# EAGLE design kakaru (EAGLE 5.11)
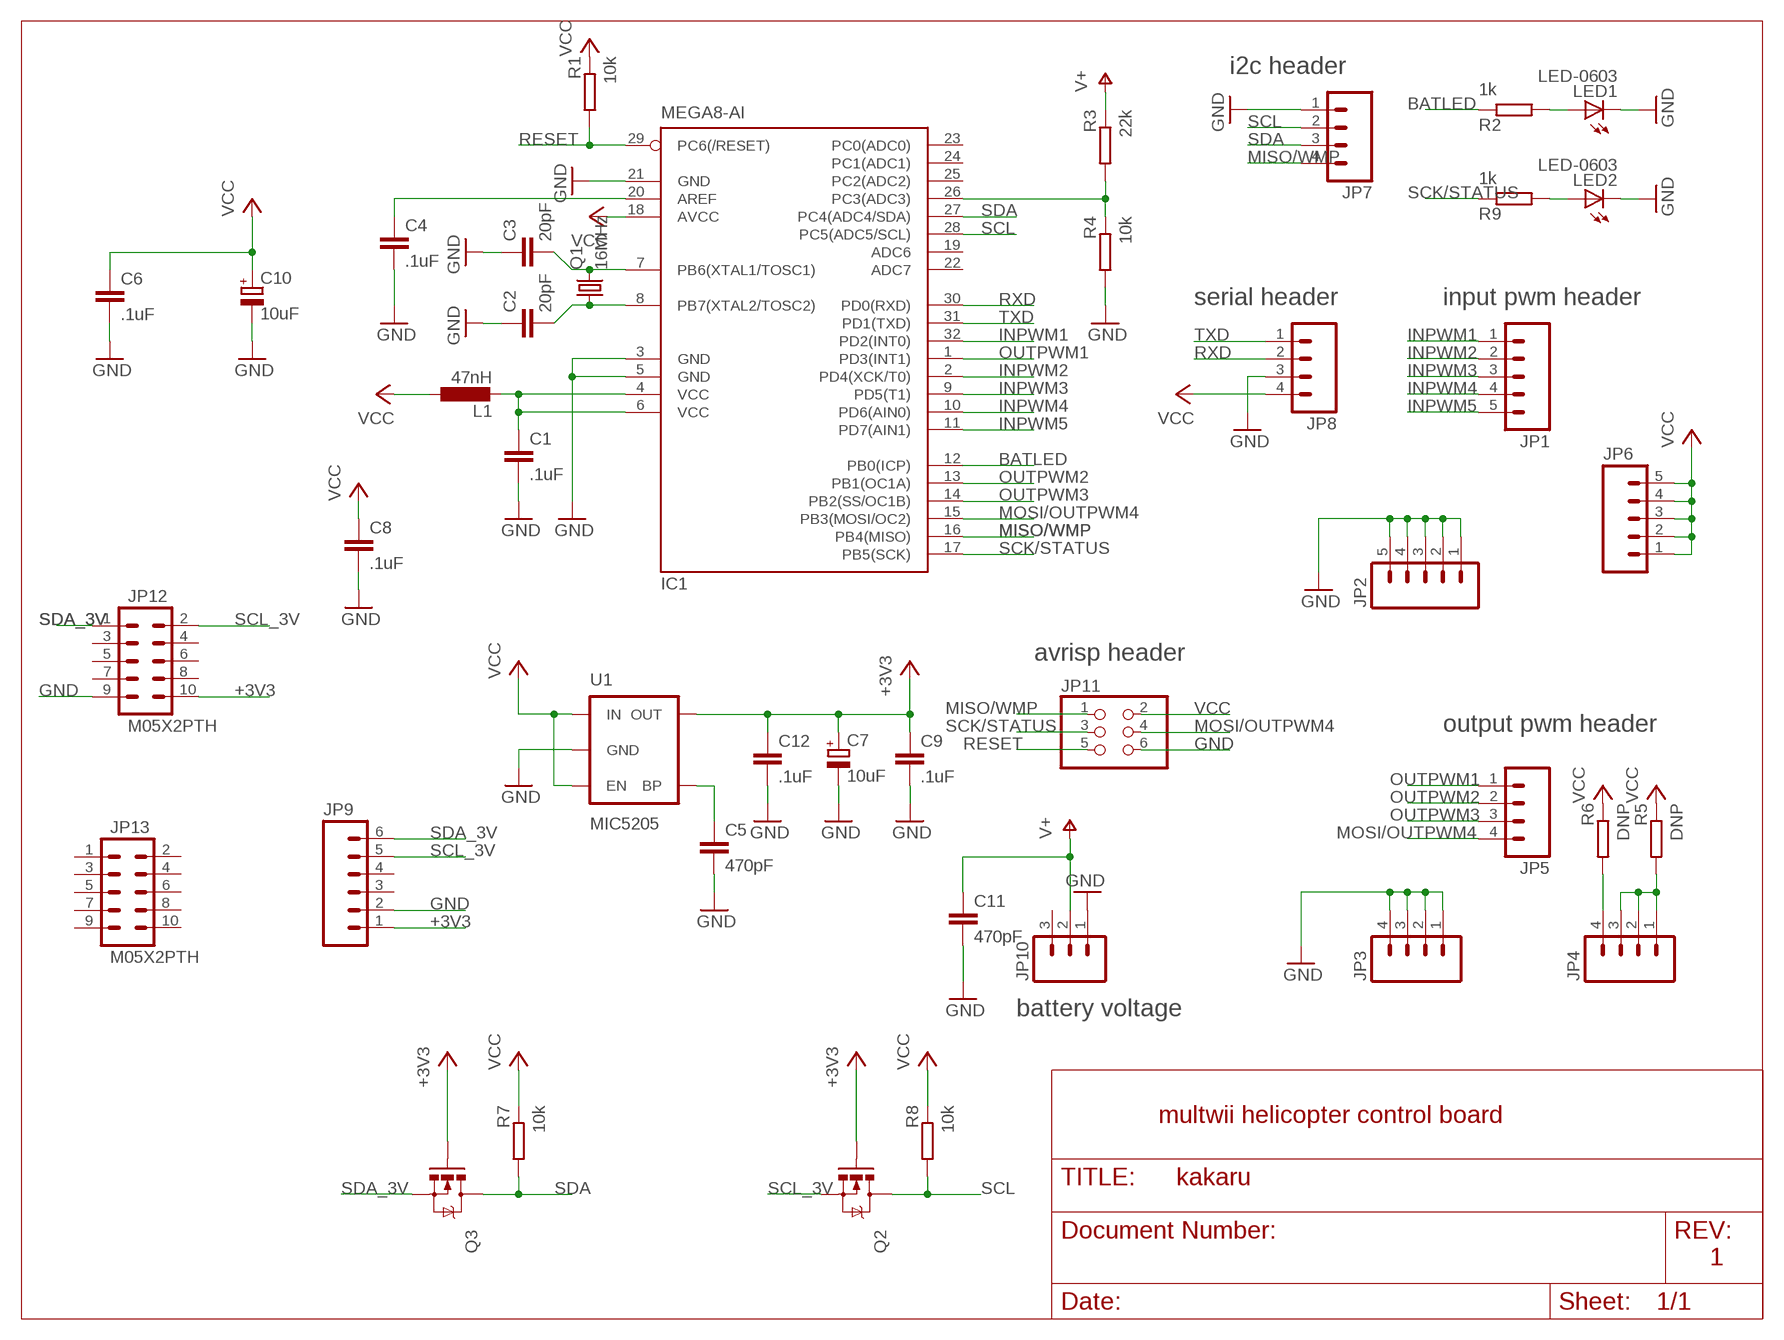
[diagram p0: schematic, sheet 1]

## Parts
C1  .1uF  CAPACITOR-0603  [0603-CAP]
C2  20pF  CAPACITOR-0603  [0603-CAP]
C3  20pF  CAPACITOR-0603  [0603-CAP]
C4  .1uF  CAPACITOR-0603  [0603-CAP]
C5  470pF  CAPACITOR-0603  [0603-CAP]
C6  .1uF  CAPACITOR-0603  [0603-CAP]
C7  10uF  CPOL-EUCT3216  [CT3216]
C8  .1uF  CAPACITOR-0603  [0603-CAP]
C9  .1uF  CAPACITOR-0603  [0603-CAP]
C10  10uF  CPOL-EUCT3216  [CT3216]
C11  470pF  CAPACITOR-0603  [0603-CAP]
C12  .1uF  CAPACITOR-0603  [0603-CAP]
IC1  MEGA8-AI  [TQFP32-08]
JP1  M05PTH  [1X05]
JP2  M05PTH  [1X05]
JP3  M04PTH  [1X04]
JP4  M04PTH  [1X04]
JP5  M04PTH  [1X04]
JP6  M05PTH  [1X05]
JP7  M04PTH  [1X04]
JP8  M04PTH  [1X04]
JP9  M06SIP  [1X06]
JP10  M03PTH  [1X03]
JP11  PINHD-2X3  [2X03]
JP12  M05X2PTH  [AVR_ICSP]
JP13  M05X2PTH  [AVR_ICSP]
L1  47nH  INDUCTOR-0603  [0603-IND]
LED1  LED-0603  [0603-LED]
LED2  LED-0603  [0603-LED]
Q1  16MHz  CRYSTALCTS406  [CTS406]
Q2  MOSFET-NCHANNELSMD  [SOT23-3]
Q3  MOSFET-NCHANNELSMD  [SOT23-3]
R1  10k  RESISTOR-0603  [0603-RES]
R2  1k  RESISTOR-0603  [0603-RES]
R3  22k  RESISTOR-0603  [0603-RES]
R4  10k  RESISTOR-0603  [0603-RES]
R5  DNP  RESISTOR-0603  [0603-RES]
R6  DNP  RESISTOR-0603  [0603-RES]
R7  10k  RESISTOR-0603  [0603-RES]
R8  10k  RESISTOR-0603  [0603-RES]
R9  1k  RESISTOR-0603  [0603-RES]
U1  MIC5205  V_REG_LDOSMD  [SOT23-5]

## Nets
+3V3: C7.+ C9.P$1 C12.P$1 JP9.1 JP12.10 Q2.1(G) Q3.1(G) U1.5(OUT)
BATLED: IC1.12(PB0(ICP)) R2.P$1
GND: C1.P$2 C2.P$1 C3.P$1 C4.P$2 C5.P$2 C6.P$2 C7.- C8.P$2 C9.P$2 C10.- C11.P$2 C12.P$2 IC1.3(GND) IC1.5(GND) IC1.21(GND) JP2.1 JP2.2 JP2.3 JP2.4 JP2.5 JP3.1 JP3.2 JP3.3 JP3.4 JP7.1 JP8.3 JP9.2 JP10.1 JP11.6 JP12.9 LED1.C LED2.C R4.P$2 U1.2(GND)
INPWM1: IC1.32(PD2(INT0)) JP1.1
INPWM2: IC1.2(PD4(XCK/T0)) JP1.2
INPWM3: IC1.9(PD5(T1)) JP1.3
INPWM4: IC1.10(PD6(AIN0)) JP1.4
INPWM5: IC1.11(PD7(AIN1)) JP1.5
MISO/WMP: IC1.16(PB4(MISO)) JP7.4 JP11.1
MOSI/OUTPWM4: IC1.15(PB3(MOSI/OC2)) JP5.4 JP11.4
N$1: C1.P$1 IC1.4(VCC) IC1.6(VCC) L1.P$2
N$2: C3.P$2 IC1.7(PB6(XTAL1/TOSC1)) Q1.3
N$3: C2.P$2 IC1.8(PB7(XTAL2/TOSC2)) Q1.1
N$4: JP4.4 R6.P$2
N$5: C5.P$1 U1.4(BP)
N$6: C4.P$1 IC1.20(AREF)
N$7: JP4.1 JP4.2 JP4.3 R5.P$2
N$8: LED1.A R2.P$2
N$9: LED2.A R9.P$2
N$11: IC1.26(PC3(ADC3)) R3.P$2 R4.P$1
OUTPWM1: IC1.1(PD3(INT1)) JP5.1
OUTPWM2: IC1.13(PB1(OC1A)) JP5.2
OUTPWM3: IC1.14(PB2(SS/OC1B)) JP5.3
RESET: IC1.29(PC6(/RESET)) JP11.5 R1.P$2
RXD: IC1.30(PD0(RXD)) JP8.2
SCK/STATUS: IC1.17(PB5(SCK)) JP11.3 R9.P$1
SCL: IC1.28(PC5(ADC5/SCL)) JP7.2 Q2.3(D) R8.P$2
SCL_3V: JP9.5 JP12.2 Q2.2(S)
SDA: IC1.27(PC4(ADC4/SDA)) JP7.3 Q3.3(D) R7.P$2
SDA_3V: JP9.6 JP12.1 Q3.2(S)
TXD: IC1.31(PD1(TXD)) JP8.1
V+: C11.P$1 JP10.2 R3.P$1
VCC: C6.P$1 C8.P$1 C10.+ IC1.18(AVCC) JP6.1 JP6.2 JP6.3 JP6.4 JP6.5 JP8.4 JP11.2 L1.P$1 R1.P$1 R5.P$1 R6.P$1 R7.P$1 R8.P$1 U1.1(IN) U1.3(EN)
Unconnected: IC1.19(ADC6) IC1.22(ADC7) IC1.23(PC0(ADC0)) IC1.24(PC1(ADC1)) IC1.25(PC2(ADC2)) JP9.3 JP9.4 JP10.3 JP12.3 JP12.4 JP12.5 JP12.6 JP12.7 JP12.8 JP13.1 JP13.2 JP13.3 JP13.4 JP13.5 JP13.6 JP13.7 JP13.8 JP13.9 JP13.10

## Notes on the sheet
- i2c header
- serial header | input pwm header
- avrisp header
- output pwm header
- battery voltage
- multwii helicopter control board
- 1

## Library data of the parts
C1-C6 C8 C9 C11 C12 = pel_dipol_comp:CAPACITOR
C7 C10 = rcl:CPOL-EU: POLARIZED CAPACITOR, European symbol
IC1 = atmel:MEGA8: MICROCONTROLLER 8 Kbytes FLASH, 1 kbytes SRAM, 512 bytes EEPROM, USART, 6-channel 10 bit ADC, 2-channel 8 bit ADC Pin compatible with Atmega48, ATMega88, ATMega168 Source: avr.lbr; MPN: ATMEGA8-16AU; OC_FARNELL: 9171371; OC_NEWARK: 73M8863
JP1 JP2 JP6 = SparkFun:M05: Header 5 Standard 5-pin 0.1" header. Use with straight break away headers (SKU : PRT-00116), right angle break away headers (PRT-00553), swiss pins (PRT-00743), machine pins (PRT-00117), and female headers (PRT-00115). Molex polarized connector foot print use with SKU : PRT-08230 with associated crimp pins and housings.
JP3-JP5 JP7 JP8 = SparkFun:M04: Header 4 Standard 4-pin 0.1" header. Use with straight break away headers (SKU : PRT-00116), right angle break away headers (PRT-00553), swiss pins (PRT-00743), machine pins (PRT-00117), and female headers (PRT-00115). Molex polarized connector foot print use with SKU : PRT-08231 with associated crimp pins and housings. 1MM SMD Version SKU: PRT-10208
JP9 = SparkFun:M06: Header 6 Standard 6-pin 0.1" header. Use with straight break away headers (SKU : PRT-00116), right angle break away headers (PRT-00553), swiss pins (PRT-00743), machine pins (PRT-00117), and female headers (PRT-00115). Molex polarized connector foot print use with SKU : PRT-08094 with associated crimp pins and housings. NOTES ON THE VARIANTS LOCK and LOCK_LONGPADS... This footprint was designed to help hold the alignment of a through-hole component (i.e. 6-pin header) while soldering it into place. You may notice that each hole has been shifted either up or down by 0.005 of an inch from it's more standard position (which is a perfectly straight line). This slight alteration caused the pins (the squares in the middle) to touch the edges of the holes. Because they are alternating, it causes a "brace" to hold the component in place. 0.005 has proven to be the perfect amount of "off-center" position when using our standard breakaway headers. Although looks a little odd when you look at the bare footprint, once you have a header in there, the alteration is very hard to notice. Also, if you push a header all the way into place, it is covered up entirely on the bottom side. This idea of altering the position of holes to aid alignment will be further integrated into the Sparkfun Library for other footprints. It can help hold any component with 3 or more connection pins.
JP10 = SparkFun:M03: Header 3 Standard 3-pin 0.1" header. Use with straight break away headers (SKU : PRT-00116), right angle break away headers (PRT-00553), swiss pins (PRT-00743), machine pins (PRT-00117), and female headers (PRT-00115). Molex polarized connector foot print use with SKU : PRT-08232 with associated crimp pins and housings.
JP11 = pinhead:PINHD-2X3: PIN HEADER
JP12 JP13 = SparkFun:M05X2: Header 5x2 Standard 10-pin dual row 0.1" header. Commonly used with AVR-ISP. Use with Spark Fun Electronics SKU: PRT-00778
L1 = pel_dipol_comp:INDUCTOR
LED1 LED2 = pel_dipol_comp:LED
Q1 = crystal:CRYSTAL: CRYSTAL; OC_FARNELL: unknown; OC_NEWARK: unknown
Q2 Q3 = SparkFun:MOSFET-NCHANNEL
R1-R9 = pel_dipol_comp:RESISTOR
U1 = SparkFun:V_REG_LDO: Voltage Regulator LDO Standard 150mA LDO voltage regulator in SOT-23 layout. Micrel part MIC5205. BP (by-pass) pin is used to lower output noise with 470pF cap.

## Board
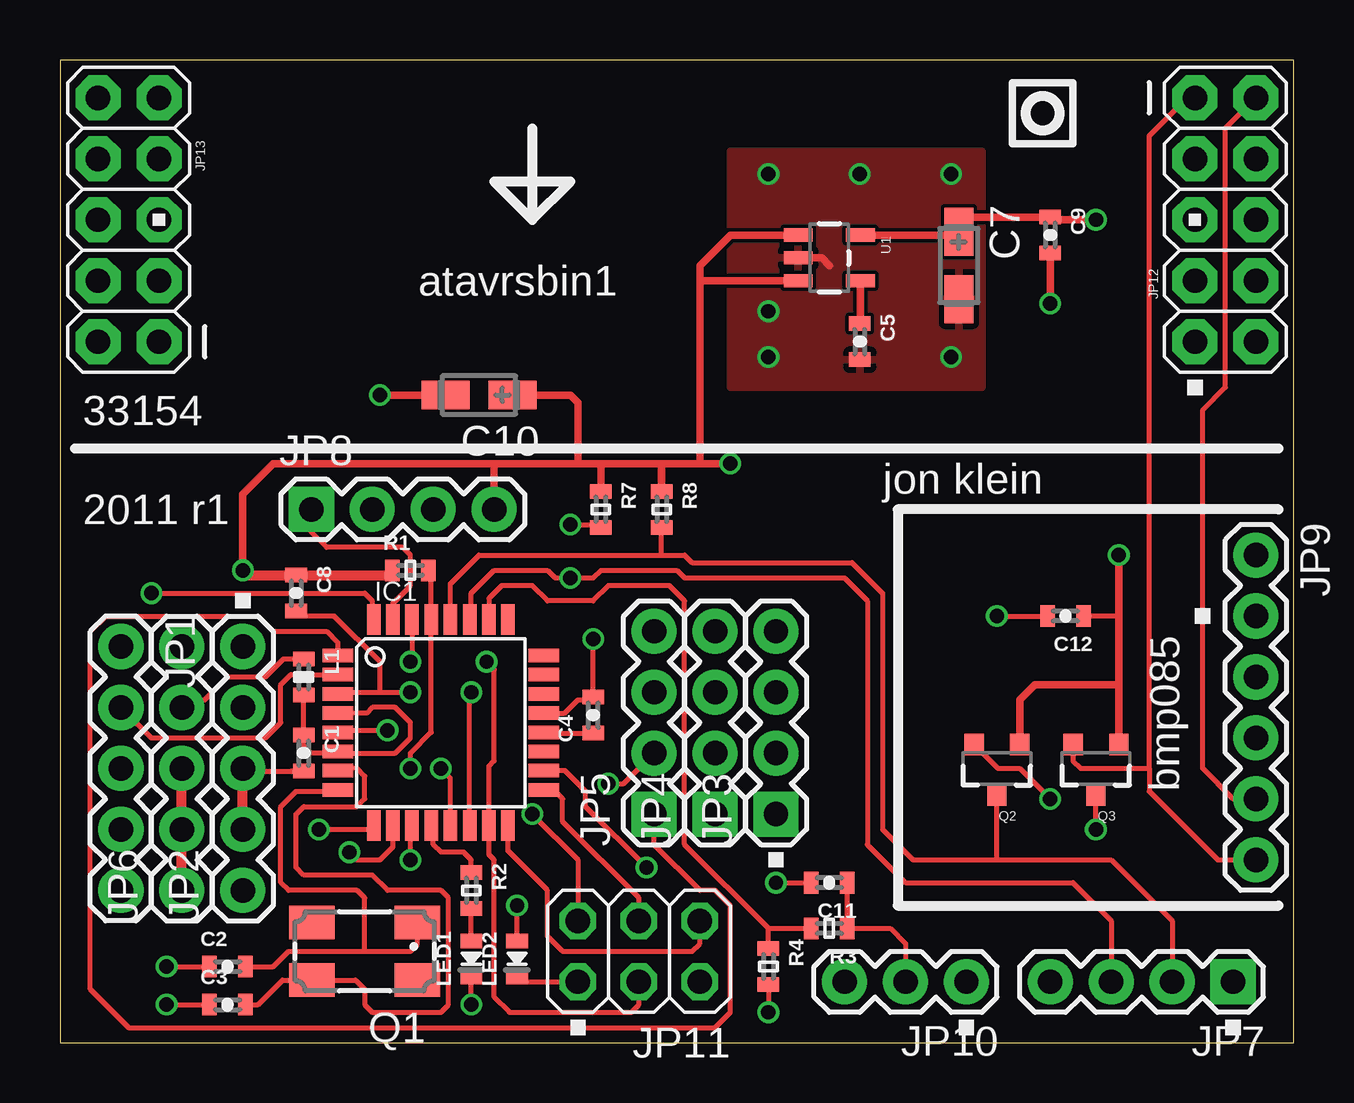
[diagram p1: board, top side]
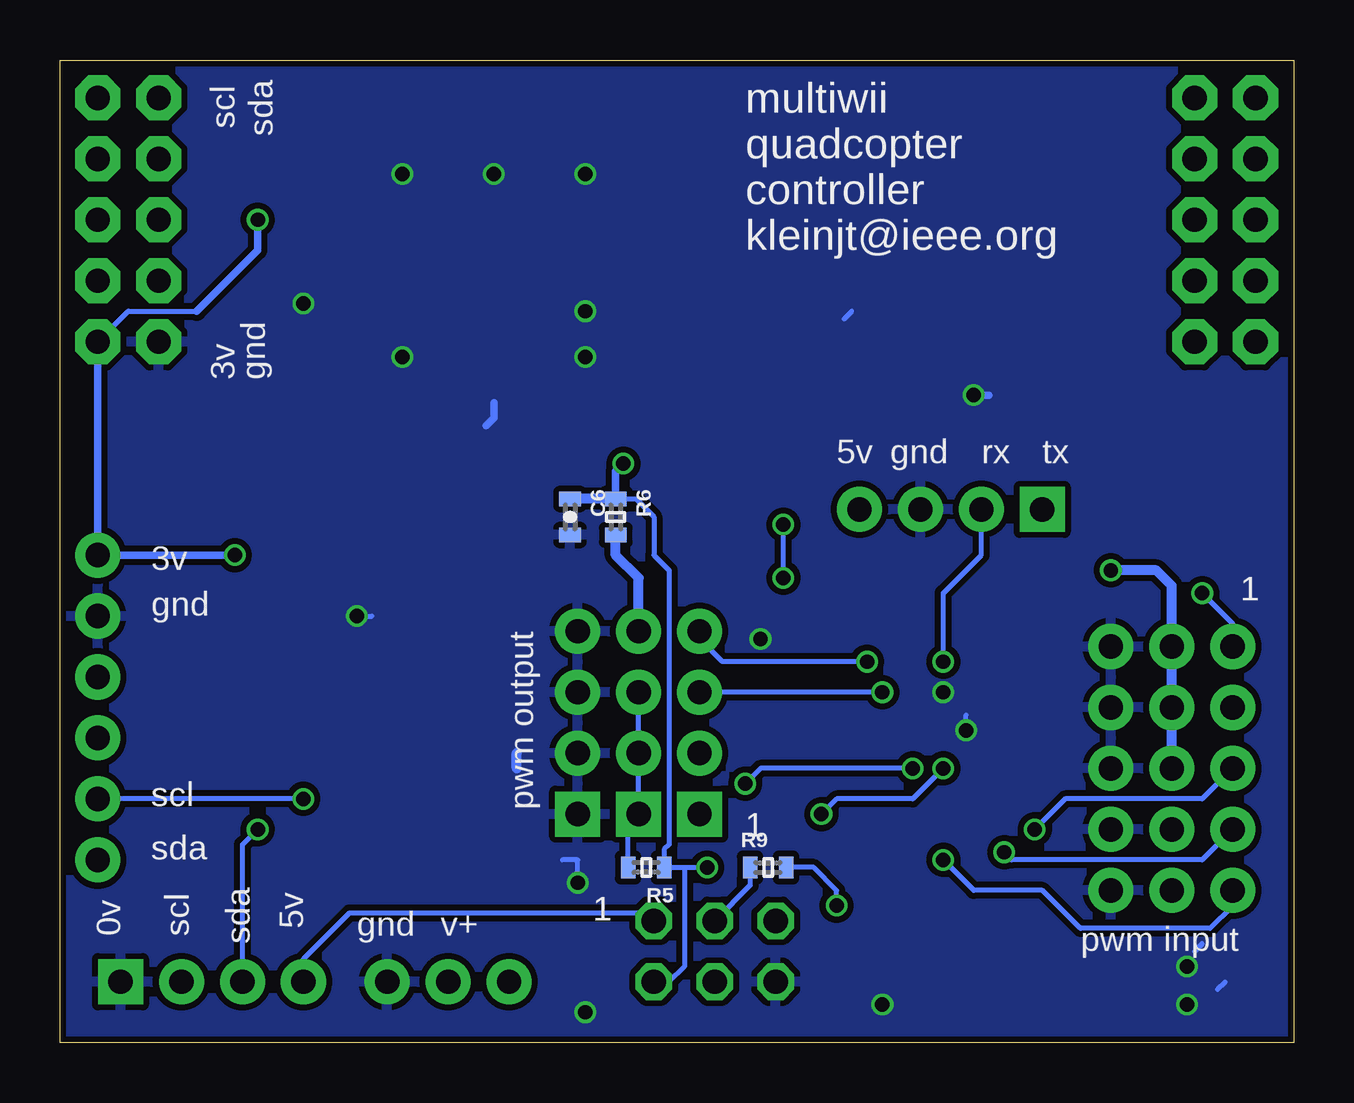
[diagram p2: board, bottom side, seen from below]

Size 51.42 x 40.95 mm. Coordinates in mm from the lower left corner, seen from the top.
Outline: 0,0 51.42,0 51.42,40.95 0,40.95 0,0
Copper layers (1*16): Top 0.035mm / dielectric 1.5mm / Bottom 0.035mm
Design rules "Fusion_eagle_rule_v1.1": minimum track width 6mil, minimum drill 12mil, track to track 6mil, track to pad 6mil, pad to pad 6mil, via to via 6mil, smd to smd 0mil, copper to edge 10mil, drill to drill 10mil, minimum pad ring 10mil, minimum via ring 6mil, stop-mask expansion 2mil, vias tented up to drill 100mil, thermal gap 10mil

### Footprints (pad centres in the part's own frame; a part is rotated, then mirrored left to right if it is on the bottom)
0603-CAP = smd 0.6 x 0.9: P$1 -0.75,0; P$2 0.75,0
CT3216 = smd 2 x 1.2: + -1.4,0; - 1.4,0
TQFP32-08 = smd 1.27 x 0.559: 1 -4.293,2.8; 2 -4.293,2; 3 -4.293,1.2; 4 -4.293,0.4; 5 -4.293,-0.4; 6 -4.293,-1.2; 7 -4.293,-2; 8 -4.293,-2.8; 17 4.293,-2.8; 18 4.293,-2; 19 4.293,-1.2; 20 4.293,-0.4; 21 4.293,0.4; 22 4.293,1.2; 23 4.293,2; 24 4.293,2.8 | smd 0.559 x 1.27: 9 -2.8,-4.293; 10 -2,-4.293; 11 -1.2,-4.293; 12 -0.4,-4.293; 13 0.4,-4.293; 14 1.2,-4.293; 15 2,-4.293; 16 2.8,-4.293; 25 2.8,4.293; 26 2,4.293; 27 1.2,4.293; 28 0.4,4.293; 29 -0.4,4.293; 30 -1.2,4.293; 31 -2,4.293; 32 -2.8,4.293
1X05 = drill 1.016 pad 1.88 round: 1 0,0; 2 2.54,0; 3 5.08,0; 4 7.62,0; 5 10.16,0
1X04 = drill 1.016 pad 1.88 square: 1 0,0 | drill 1.016 pad 1.88 round: 2 2.54,0; 3 5.08,0; 4 7.62,0
1X06 = drill 1.016 pad 1.88 round: 1 0,0; 2 2.54,0; 3 5.08,0; 4 7.62,0; 5 10.16,0; 6 12.7,0
1X03 = drill 1.016 pad 1.88 round: 1 0,0; 2 2.54,0; 3 5.08,0
2X03 = drill 1.016 octagon: 1 -2.54,-1.27; 2 -2.54,1.27; 3 0,-1.27; 4 0,1.27; 5 2.54,-1.27; 6 2.54,1.27
AVR_ICSP = drill 1.016 pad 1.88 octagon: 1 -1.27,5.08; 2 1.27,5.08; 3 -1.27,2.54; 4 1.27,2.54; 5 -1.27,0; 6 1.27,0; 7 -1.27,-2.54; 8 1.27,-2.54; 9 -1.27,-5.08; 10 1.27,-5.08
0603-IND = smd 0.6 x 0.9: P$1 -0.75,0; P$2 0.75,0
0603-LED = smd 0.6 x 0.9: A 0.75,0; C -0.75,0
CTS406 = smd 1.9 x 1.4: 1 -2.2,-1.2; 2 2.2,-1.2; 3 2.2,1.2; 4 -2.2,1.2
SOT23-3 = smd 0.8 x 0.9: 1 -0.95,-1; 2 0.95,-1; 3 0,1.1
0603-RES = smd 0.6 x 0.9: P$1 -0.75,0; P$2 0.75,0
SOT23-5 = smd 0.55 x 1.2: 1 -0.95,-1.3; 2 0,-1.3; 3 0.95,-1.3; 4 0.95,1.3; 5 -0.95,1.3

### Placement (x,y rotation side)
C1  10.16,12.06 270 top
C2  6.99,3.17 0 top
C3  6.99,1.59 0 top
C4  22.23,13.65 90 top
C5  33.34,29.21 270 top
C6  30.16,21.91 270 bottom
C7  37.47,32.38 270 top
C8  9.84,18.73 270 top
C9  41.27,33.66 270 top
C10  17.46,26.99 180 top
C11  32.07,6.67 180 top
C12  41.91,17.78 180 top
IC1  15.88,13.34 0 top
JP1  2.54,16.51 270 top
JP2  7.62,6.35 90 top
JP3  29.84,9.53 90 top
JP4  27.3,9.53 90 top
JP5  24.77,9.53 90 top
JP6  5.08,6.35 90 top
JP7  48.9,2.54 180 top
JP8  10.48,22.23 0 top
JP9  49.85,20.32 270 top
JP10  37.78,2.54 180 top
JP11  24.13,3.81 180 top
JP12  48.58,34.29 0 top
JP13  2.86,34.29 180 top
L1  10.16,15.24 270 top
LED1  17.14,3.49 90 top
LED2  19.05,3.49 90 top
Q1  12.7,3.81 180 top
Q2  39.05,11.43 180 top
Q3  43.18,11.43 180 top
R1  14.61,19.68 0 top
R2  17.14,6.35 270 top
R3  32.07,4.76 180 top
R4  29.53,3.17 270 top
R5  26.99,7.3 180 bottom
R6  28.26,21.91 270 bottom
R7  22.54,22.23 270 top
R8  25.08,22.23 270 top
R9  21.91,7.3 0 bottom
U1  32.07,32.7 270 top

### Tracks (layer width: path | path; a pad name or v marks a point on that pad's centre or on a via)
+3V3  (via drill 0.6)
  Top 0.203: Q3.1 | Q2.1 | 44.13,17.78 C12.P$1
  Top 0.305: 44.13,14.92 Q3.1 | 44.13,14.92 44.13,17.78 44.13,19.05 v44.13,20.32 | Q2.1 40.01,14.29 40.64,14.92 44.13,14.92 | U1.5 37.33,33.65 C7.+ 37.47,34.29 37.58,34.41 C9.P$1 41.27,34.29 v43.18,34.29
  Bottom 0.203: 45.72,30.48 48.58,30.48 JP12.10
  Bottom 0.305: v44.13,20.32 JP9.1 JP12.10 | v43.18,34.29 43.18,33.02 45.72,30.48
BATLED
  Top 0.203: IC1.12 15.56,8.96 15.56,8.26 15.88,7.94 16.83,7.94 17.14,7.62 R2.P$1
GND  (via drill 0.6)
  Top 0.203: 11.14,12.94 IC1.5 11.66,13.02 v13.65,13.02 | v4.45,1.59 C3.P$1 | v4.45,3.17 C2.P$1 | 13.34,14.61 13.34,15.88 11.43,17.78 10.04,17.78 C8.P$2 | 9.64,11.31 C1.P$2 7.74,11.31 JP2.3 | IC1.3 11.65,14.61 13.34,14.61 | 13.34,14.61 v14.61,14.61 | v17.14,1.59 LED1.C | R4.P$2 v29.53,1.27 | v29.84,6.67 C11.P$2 | IC1.21 21.04,13.73 21.59,14.29 22.11,14.29 C4.P$2 v22.23,16.83 | LED2.C 19.25,2.54 JP11.6 | v39.05,17.78 C12.P$2
  Top 0.305: C9.P$2 41.39,33.02 | C9.P$2 41.27,33.02 | C9.P$2 v41.27,30.8 | v13.34,26.99 C10.- | U1.2 31.75,32.7 32.07,32.38
  Top 0.406: JP2.2 JP2.3
  Bottom 0.203: 30.48,7.62 29.84,7.62 v29.84,6.67 | 3.17,2.22 2.86,2.54 | 3.81,4.13 4.13,3.81 | v13.65,13.02 13.65,13.65 | v14.61,14.61 14.92,14.61 | v29.53,1.27 29.84,1.27 | 18.73,30.16 18.41,30.48 | v22.23,16.83 22.23,17.14 | v39.05,17.78 38.42,17.78
  Bottom 0.305: v13.34,26.99 12.7,26.99 | 33.34,26.67 33.34,26.04 33.66,25.72
  Bottom 0.406: 32.38,11.43 32.38,12.06
  other vias: 37.15,28.57 29.53,28.57 29.53,30.48 29.53,36.2 37.15,36.2 33.34,36.2
  pour Bottom (isolate 0.254): 0.32,40.96 0,0 51.12,0 51.44,40.96
  pour Top: 27.94,37.15 27.94,27.3 38.42,27.3 38.42,37.15
INPWM1  (via drill 0.6)
  Top 0.203: IC1.32 13.02,17.68 13.02,18.41 12.7,18.73 v3.81,18.73
  Bottom 0.203: v3.81,18.73 2.54,17.46 JP1.1
INPWM2
  Top 0.203: IC1.2 9.62,15.34 9.21,14.92 9.21,13.34 8.57,12.7 3.81,12.7 JP1.2
INPWM3  (via drill 0.6)
  Top 0.203: v10.79,8.89 12.92,8.89 IC1.9
  Bottom 0.203: JP1.3 3.81,10.16 9.53,10.16 v10.79,8.89
INPWM4  (via drill 0.6)
  Top 0.203: IC1.10 13.88,8.16 13.34,7.62 12.38,7.62 v12.06,7.94
  Bottom 0.203: JP1.4 3.81,7.62 11.75,7.62 v12.06,7.94
INPWM5  (via drill 0.6)
  Top 0.203: 14.68,9.46 IC1.11 14.61,8.97 v14.61,7.62
  Bottom 0.203: v14.61,7.62 13.34,6.35 10.48,6.35 8.89,4.76 3.49,4.76 2.54,5.71 JP1.5
MISO/WMP
  Top 0.203: JP11.1 26.67,4.13 26.35,3.81 20.95,3.81 20.32,4.45 20.32,6.35 18.68,8 IC1.16
  Bottom 0.203: JP7.4 41.27,3.49 39.37,5.4 26.99,5.4 JP11.1
MOSI/OUTPWM4  (via drill 0.6)
  Top 0.203: JP11.4 24.13,1.59 23.81,1.27 18.73,1.27 18.1,1.91 18.1,7.62 17.88,7.84 IC1.15 17.88,11.53 18.1,11.75 18.1,15.56 v17.78,15.88
  Bottom 0.203: v17.78,15.88 23.81,15.88 24.77,16.83 JP5.4
N$1
  Top 0.203: L1.P$2 C1.P$1 10.16,12.38 10.48,12.06 11.51,12.06 IC1.6 11.65,12.06 13.97,12.06 14.61,12.7 14.61,13.34 13.97,13.97 13.02,13.97 12.78,13.73 IC1.4
N$2
  Top 0.203: IC1.7 11.68,11.43 12.38,11.43 12.7,11.11 12.7,10.16 12.38,9.84 10.16,9.84 9.84,9.53 9.84,7.3 10.16,6.99 13.02,6.99 13.65,6.35 15.88,6.35 16.19,6.03 16.19,1.59 15.88,1.27 13.02,1.27 12.7,1.59 12.7,2.22 12.31,2.61 Q1.3 9.28,2.61 8.26,1.59 C3.P$2
N$3
  Top 0.203: C2.P$2 8.89,3.17 9.53,3.81 12.7,3.81 | 12.7,3.81 14.61,3.81 14.9,4.11 Q1.1 | IC1.8 11.53,10.48 9.84,10.48 9.21,9.84 9.21,6.67 9.53,6.35 12.38,6.35 12.7,6.03 12.7,3.81
N$4
  Bottom 0.406: JP4.4 27.3,19.37 28.26,20.32 R6.P$2
N$5
  Top 0.305: U1.4 33.37,29.99 C5.P$1
N$6
  Top 0.203: IC1.20 20.2,12.9 C4.P$1
N$7
  Bottom 0.203: R5.P$2 27.74,9.09 JP4.1 JP4.2 JP4.3
N$8
  Top 0.203: LED1.A R2.P$2
N$9  (via drill 0.6)
  Top 0.203: LED2.A v19.05,5.71
  Bottom 0.203: R9.P$2 20,7.3 19.05,6.35 v19.05,5.71
N$11
  Top 0.203: 17.78,17.72 IC1.26 17.88,18.51 18.41,19.05 19.68,19.05 20.32,18.41 22.23,18.41 22.86,19.05 25.4,19.05 26.04,18.41 26.04,8.26 29.53,4.76 | 31.11,4.56 R3.P$2 29.53,4.76 | R4.P$1 29.53,4.76
OUTPWM1
  Top 0.203: IC1.1 11.58,16.68 11.11,17.14 8.89,17.14 8.26,17.78 1.91,17.78 1.27,17.14 1.27,2.22 2.86,0.64 27.3,0.64 27.94,1.27 27.94,5.71 27.3,6.35 26.67,6.35 24.77,8.26 JP5.1
OUTPWM2  (via drill 0.6)
  Top 0.203: IC1.13 16.27,11.03 v15.88,11.43 | v22.86,10.79 23.5,10.79 JP5.2
  Bottom 0.203: v15.88,11.43 22.23,11.43 v22.86,10.79
OUTPWM3  (via drill 0.6)
  Top 0.203: IC1.14 17.07,14.54 v17.14,14.61
  Bottom 0.203: v17.14,14.61 JP5.3
RESET  (via drill 0.6)
  Top 0.203: R1.P$2 15.47,19.57 IC1.29 15.47,12.94 14.61,12.06 v14.61,11.43 | v19.68,9.53 21.59,7.62 JP11.5
  Bottom 0.203: v19.68,9.53 19.05,10.16 15.88,10.16 v14.61,11.43
RXD  (via drill 0.6)
  Top 0.203: IC1.30 14.68,15.95 v14.61,15.88
  Bottom 0.203: v14.61,15.88 14.61,18.73 13.02,20.32 JP8.2
SCK/STATUS
  Top 0.203: JP11.3 24.13,6.03 20.95,9.21 20.95,10.16 20.58,10.54 IC1.17 20.11,10.48
  Bottom 0.203: R9.P$1 22.66,6.55 JP11.3
SCL
  Top 0.203: IC1.28 16.27,19.13 17.46,20.32 25.08,20.32 | 25.08,20.32 26.04,20.32 26.35,20 33.02,20 34.29,18.73 34.29,8.89 35.56,7.62 39.05,7.62 | JP7.2 46.35,5.08 43.81,7.62 39.05,7.62 | 39.05,7.62 Q2.3 | 25.08,20.32 R8.P$2
SCL_3V  (via drill 0.6)
  Top 0.203: Q2.2 39.1,11.43 40.01,11.43 v41.27,10.16 | JP12.2 48.58,38.1 48.58,27.3 47.62,26.35 47.62,11.43 48.9,10.16 JP9.5
  Bottom 0.203: v41.27,10.16 JP9.5
SDA  (via drill 0.6)
  Top 0.203: IC1.27 17.14,17.7 17.14,18.73 18.1,19.68 20.32,19.68 20.64,19.37 v21.27,19.37 22.23,19.37 22.54,19.68 25.72,19.68 26.04,19.37 32.7,19.37 33.66,18.41 33.66,8.26 35.24,6.67 42.23,6.67 43.81,5.08 JP7.3 | v43.18,8.89 Q3.3 | R7.P$2 22.54,21.59 v21.27,21.59
  Bottom 0.203: v43.18,8.89 43.81,8.26 JP7.3 | v21.27,19.37 v21.27,21.59
SDA_3V
  Top 0.203: JP9.6 48.26,7.62 45.4,10.48 45.4,11.43 | Q3.2 42.23,11.75 42.55,11.43 45.4,11.43 | JP12.1 46.99,39.37 45.4,37.78 45.4,11.43
TXD
  Top 0.203: IC1.31 13.88,18.32 14.61,19.05 14.61,20.32 14.29,20.64 11.11,20.64 10.48,21.27 JP8.1
V+
  Top 0.203: R3.P$1 32.7,4.88 | R3.P$1 34.61,4.76 35.24,4.13 JP10.2 | R3.P$1 C11.P$1
VCC  (via drill 0.6)
  Top 0.203: IC1.18 21.05,11.34 21.91,10.48 21.91,9.84 v24.45,7.3 | L1.P$1 9.32,15.99 8.57,15.24 6.99,15.24 6.03,14.29 5.4,14.29 JP6.4
  Top 0.305: 29.21,31.75 U1.3 26.67,31.75 | U1.1 27.94,33.65 26.67,32.38 26.67,31.75 | v7.62,19.68 7.62,22.86 8.89,24.13 18.1,24.13 | 18.1,24.13 21.59,24.13 | 21.59,24.13 22.54,24.13 | 25.08,24.13 26.67,24.13 | 26.67,24.13 v27.94,24.13 | 18.1,24.13 JP8.4 | C10.+ 21.27,26.99 21.59,26.67 21.59,24.13 | 22.54,24.13 R7.P$1 | 25.08,24.13 R8.P$1 | 22.54,24.13 25.08,24.13 | 26.67,24.13 26.67,31.75
  Top 0.406: v7.62,19.68 7.82,19.48 C8.P$1 13.65,19.48 R1.P$1 | JP6.3 JP6.2 JP6.1
  Bottom 0.203: JP11.2 26.04,2.54 25.4,3.17 25.4,7.3 | R5.P$1 26.04,7.5 | 25.4,7.3 v24.45,7.3 | R5.P$1 25.4,7.3 | R5.P$1 26.24,8.05 26.04,8.26 26.04,19.68 26.67,20.32 26.67,21.91 27.42,22.66 R6.P$1
  Bottom 0.305: v27.94,24.13 28.26,23.81 R6.P$1
  Bottom 0.406: JP6.3 JP6.4 JP6.5 5.08,19.05 5.71,19.68 v7.62,19.68 | R6.P$1 C6.P$1

### Text on the board
_tsilk: atavrsbin1 | 33154 | jon klein | 2011 r1 | bmp085
_bsilk: multiwii | sda | scl | quadcopter | controller | kleinjt@ieee.org | gnd | 3v | tx | rx | gnd | 5v | 3v | 1 | gnd | pwm output | scl | 1 | sda | 1 | 5v | pwm input | v+ | gnd | sda | scl | 0v